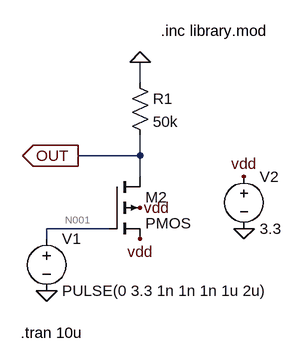
[diagram p0: schematic Draft8.asc]
Draft8.asc, the LTspice schematic file:
Version 4
SHEET 1 880 680
WIRE 48 160 48 128
WIRE 48 272 48 240
WIRE 48 272 -48 272
WIRE 48 304 48 272
WIRE 0 384 -96 384
WIRE -96 400 -96 384
FLAG -48 272 OUT
IOPIN -48 272 Out
FLAG -96 480 0
FLAG 48 352 vdd
FLAG 48 400 vdd
FLAG 48 128 0
FLAG 208 384 0
FLAG 208 304 vdd
SYMBOL res 32 144 R0
SYMATTR InstName R1
SYMATTR Value 50k
SYMBOL voltage -96 384 R0
WINDOW 123 0 0 Left 0
WINDOW 39 0 0 Left 0
SYMATTR InstName V1
SYMATTR Value PULSE(0 3.3 1n 1n 1n 1u 2u)
SYMBOL pmos4 0 304 R0
SYMATTR InstName M2
SYMATTR Value2 l=0.35u w=4u
SYMBOL voltage 208 288 R0
WINDOW 123 0 0 Left 0
WINDOW 39 0 0 Left 0
SYMATTR InstName V2
SYMATTR Value 3.3
TEXT 80 80 Left 2 !.inc library.mod
TEXT -136 544 Left 2 !.tran 10u

The netlist it stands for:
* Draft8.asc
R1 0 OUT 50k
V1 N001 0 PULSE(0 3.3 1n 1n 1n 1u 2u)
M2 OUT N001 vdd vdd PMOS l=0.35u w=4u
V2 vdd 0 3.3
.model NMOS NMOS
.model PMOS PMOS
.lib standard.mos
.inc library.mod
.tran 10u
.backanno
.end

* Results of the author's LTspice run, read from the files saved beside the schematic
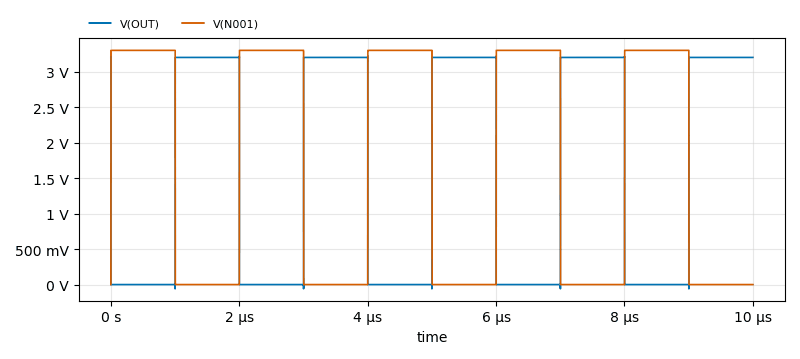
[diagram p1: Transient Analysis of Draft8.asc, plotted from the saved traces]
* Transient Analysis, 1 run:
*   V(OUT): min -59.78 mV, max 3.214 V, average 1.599 V, rms 2.262 V, last 3.2 V
*   V(N001): min 0 V, max 3.3 V, average 1.652 V, rms 2.334 V, last 0 V